# EAGLE design croc (EAGLE 6.3)
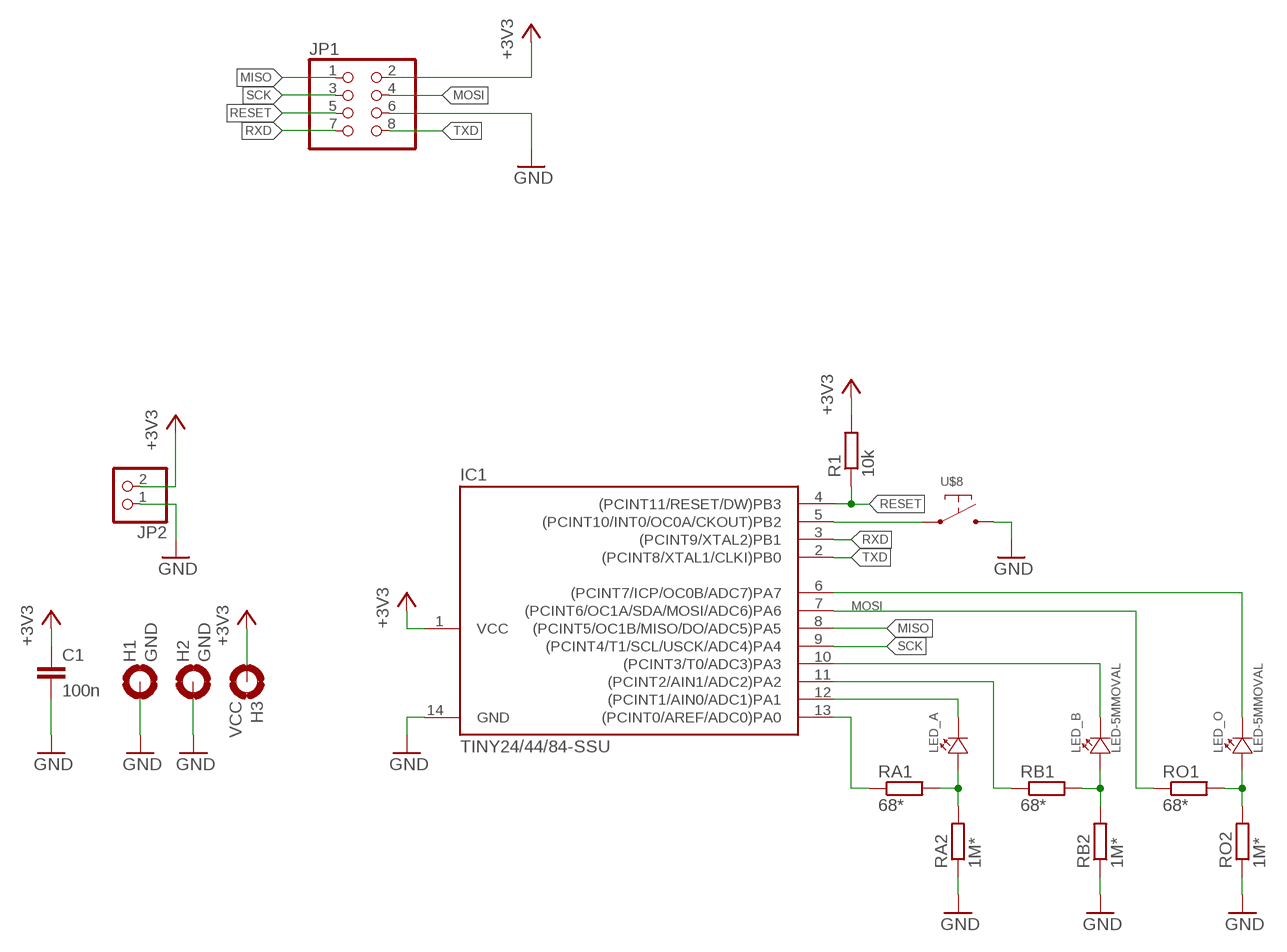
[diagram p0: schematic, sheet 1]

## Parts
C1  100n  C-EUC0603  [C0603]
H1  GND  MOUNT-PAD-ROUND3.0  [3,0-PAD]
H2  GND  MOUNT-PAD-ROUND3.0  [3,0-PAD]
H3  VCC  MOUNT-PAD-ROUND3.0  [3,0-PAD]
IC1  TINY24/44/84-SSU  [SOIC14]
JP1  PINHD-2X4/EDGE  [2X04/EDGE]
JP2  PINHD-1X2  [1X02]
LED_A  LED-5MMOVAL  [LED-5MM-EDGE-OVAL]
LED_B  LED-5MMOVAL  [LED-5MM-EDGE-OVAL]
LED_O  LED-5MMOVAL  [LED-5MM-EDGE-OVAL]
R1  10k  R-EU_R0603  [R0603]
RA1  68*  R-EU_R0603  [R0603]
RA2  1M*  R-EU_R0603  [R0603]
RB1  68*  R-EU_R0603  [R0603]
RB2  1M*  R-EU_R0603  [R0603]
RO1  68*  R-EU_R0603  [R0603]
RO2  1M*  R-EU_R0603  [R0603]
U$8  SWITCH-DEFAULT_OFF-NO_SILK  [SWITCH-GENERIC-4_PIN-NO_SILK]

## Nets
+3V3: C1.1 H3.B3,0(MOUNT) IC1.1(VCC) JP1.2 JP2.2 R1.2
GND: C1.2 H1.B3,0(MOUNT) H2.B3,0(MOUNT) IC1.14(GND) JP1.6 JP2.1 RA2.1 RB2.1 RO2.1 U$8.P$3 U$8.P$4
LED_A-C: IC1.12((PCINT1/AIN0/ADC1)PA1) LED_A.K(C)
LED_A-M: LED_A.A RA1.2 RA2.2
LED_A-S: IC1.13((PCINT0/AREF/ADC0)PA0) RA1.1
LED_B-C: IC1.10((PCINT3/T0/ADC3)PA3) LED_B.K(C)
LED_B-M: LED_B.A RB1.2 RB2.2
LED_B-S: IC1.11((PCINT2/AIN1/ADC2)PA2) RB1.1
LED_O-C: IC1.6((PCINT7/ICP/OC0B/ADC7)PA7) LED_O.K(C)
LED_O-M: LED_O.A RO1.2 RO2.2
MISO: IC1.8((PCINT5/OC1B/MISO/DO/ADC5)PA5) JP1.1
MOSI: IC1.7((PCINT6/OC1A/SDA/MOSI/ADC6)PA6) JP1.4 RO1.1
N$2: IC1.5((PCINT10/INT0/OC0A/CKOUT)PB2) U$8.P$1 U$8.P$2
RESET: IC1.4((PCINT11/RESET/DW)PB3) JP1.5 R1.1
RXD: IC1.3((PCINT9/XTAL2)PB1) JP1.7
SCK: IC1.9((PCINT4/T1/SCL/USCK/ADC4)PA4) JP1.3
TXD: IC1.2((PCINT8/XTAL1/CLKI)PB0) JP1.8

## Library data of the parts
C1 = p.peter-rcl:C-EU: CAPACITOR, European symbol; DIGIKEY: 311-1343-1-ND
H1-H3 = holes:MOUNT-PAD-ROUND: MOUNTING PAD, round
IC1 = avr:TINY24/44/84; DIGIKEY: ATTINY84A-SSU-ND
JP1 = pinhead-mod:PINHD-2X4: PIN HEADER
JP2 = pinhead:PINHD-1X2: PIN HEADER
LED_A LED_B LED_O = p.peter-leds:LED-5MM
R1 = p.peter-rcl:R-EU_: RESISTOR, European symbol; DIGIKEY: 311-10KGRCT-ND
RA1 RA2 RB1 RB2 RO1 RO2 = p.peter-rcl:R-EU_: RESISTOR, European symbol
U$8 = p.peter-passives:SWITCH-DEFAULT_OFF

## Board
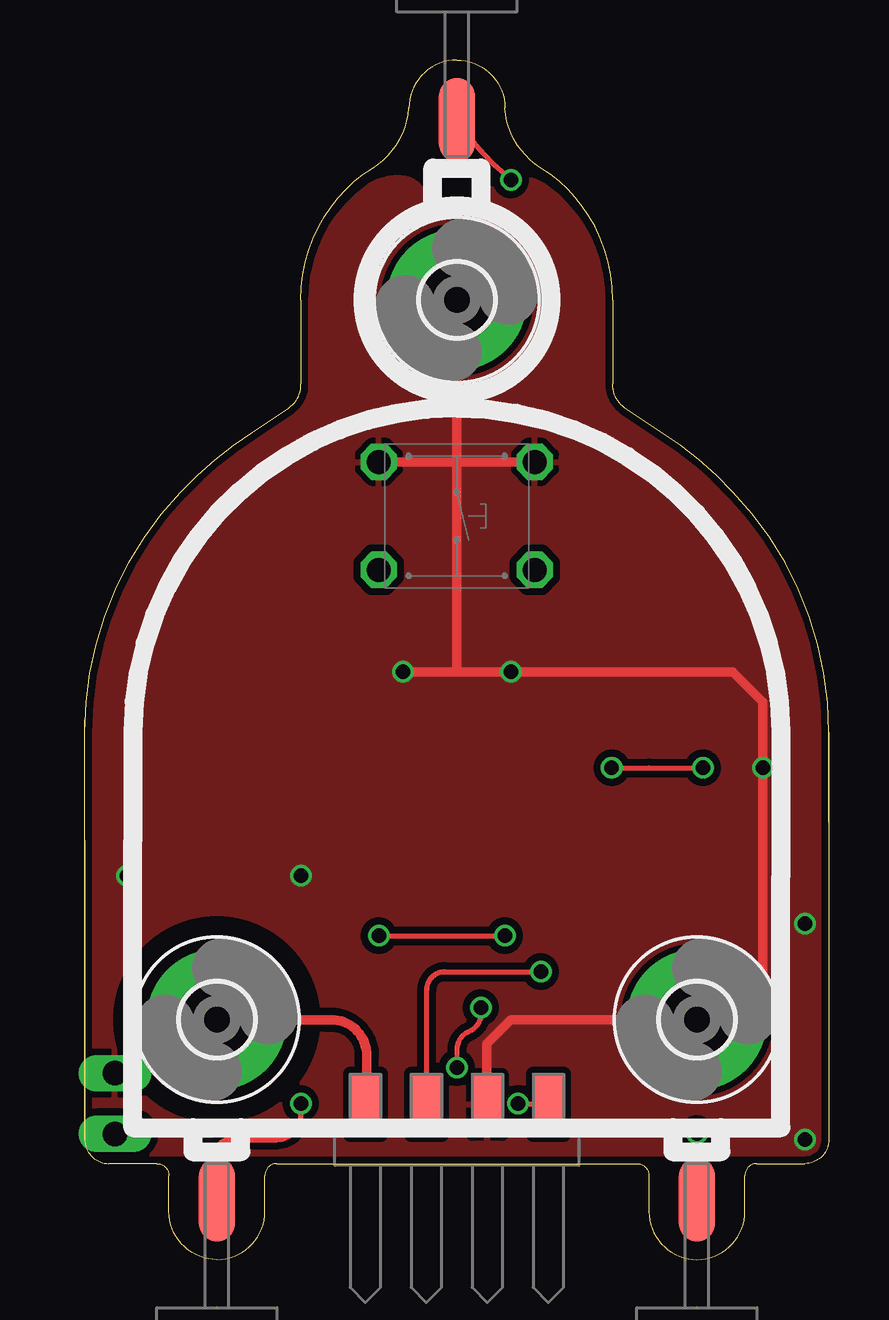
[diagram p1: board, top side]
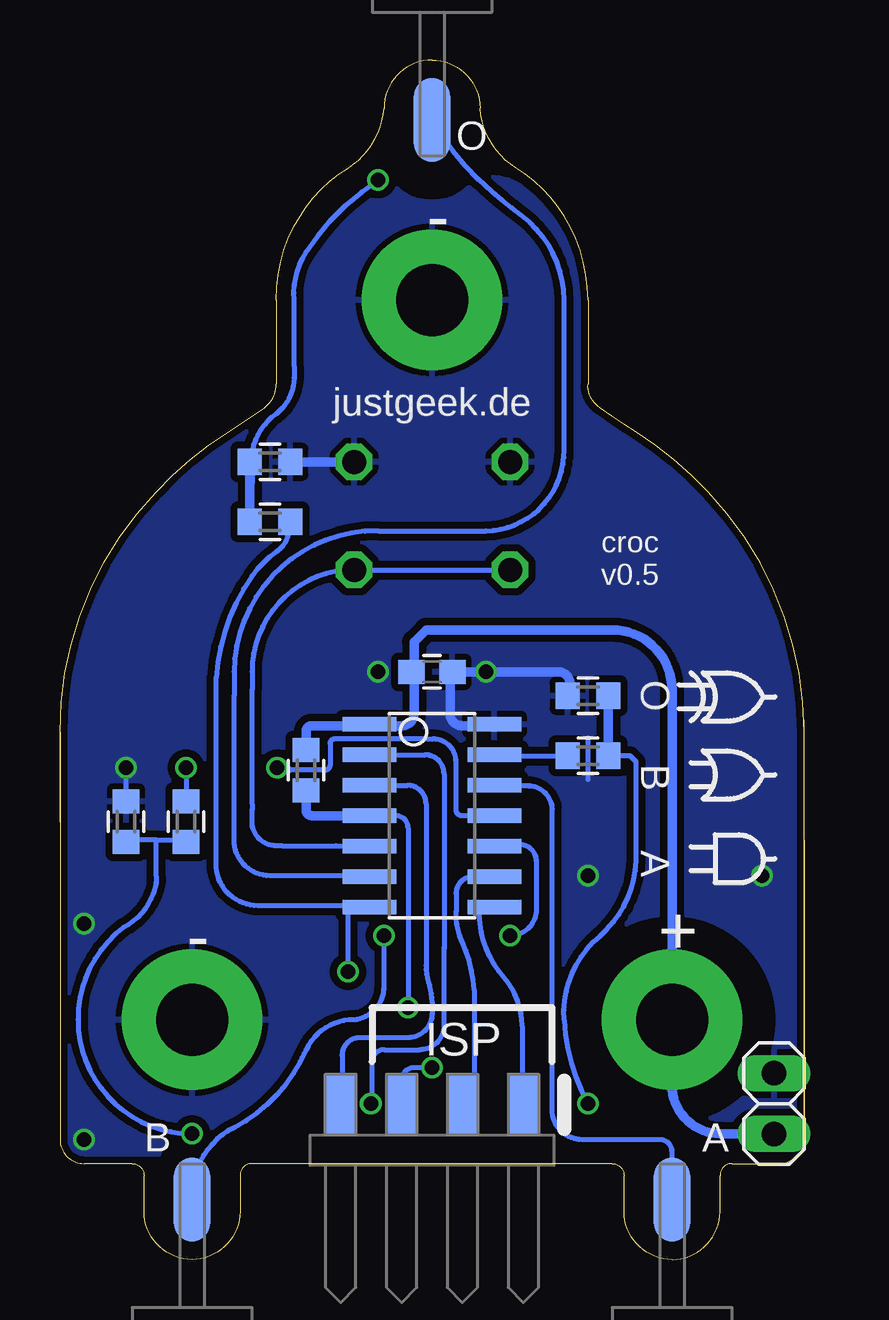
[diagram p2: board, bottom side, seen from below]

Size 31 x 50 mm. Coordinates in mm from the lower left corner, seen from the top.
Outline: 0,17.5 0,5
Outline: 31,18.25 31,22
Outline: 31,22 31,18.25
Outline: 31,18.25 31,5 arc-90 30,4 28,4 arc90 27.5,3.5 27.5,2 arc-90 25.5,0 arc-90 23.5,2 23.5,3.5 arc90 23,4 8,4 arc90 7.5,3.5 7.5,2 arc-90 5.5,0 arc-90 3.5,2 3.5,3.5 arc90 3,4 1,4 arc-90 0,5
Outline: 22,40 arc32 21,43.5
Outline: 21,43.5 arc26 19,45.5 arc-54 17.5,48 arc90 15.5,50 arc90 13.5,48 arc-54 12,45.5 arc26 10,43.5 arc32 9,40 9,36.5 arc-59 8.5,35.5 arc-1 7,34.5 arc13 4,32 arc44 0,22
Outline: 0,5 0,17.5
Outline: 0,17.5 0,18
Outline: 0,18 0,19
Outline: 0,19 0,19.5
Outline: 0,18 0,19
Outline: 0,19 0,19.5
Outline: 0,18 0,19
Outline: 0,19 0,19.5
Outline: 22,40 arc32 21,43.5
Outline: 22,40 22,37
Outline: 0,19.5 0,22
Outline: 0,22 0,22.5
Outline: 0,19 0,22
Outline: 22,40 22,37
Outline: 22,37 22,36.5 arc59 22.5,35.5 arc1 24,34.5 arc-13 27,32 arc-44 31,22
Copper layers (1*16): Top 0.035mm / dielectric 1.5mm / Bottom 0.035mm
Design rules "Fusion_eagle_rule_v1.1": minimum track width 6mil, minimum drill 12mil, track to track 6mil, track to pad 6mil, pad to pad 6mil, via to via 6mil, smd to smd 0mil, copper to edge 10mil, drill to drill 10mil, minimum pad ring 10mil, minimum via ring 6mil, stop-mask expansion 2mil, vias tented up to drill 100mil, thermal gap 10mil
tRestrict: area 1.5,6 to 9.5,14; 29 lines
bRestrict: area 1.5,6 to 9.5,14; 33 lines

### Footprints (pad centres in the part's own frame; a part is rotated, then mirrored left to right if it is on the bottom)
C0603 = smd 1.1 x 1: 1 -0.85,0; 2 0.85,0
3,0-PAD = drill 3 pad 5.842: B3,0 0,0
SOIC14 = smd 0.61 x 2.21: 1 -3.81,-2.603; 2 -2.54,-2.603; 3 -1.27,-2.603; 4 0,-2.603; 5 1.27,-2.603; 6 2.54,-2.603; 7 3.81,-2.603; 8 3.81,2.603; 9 2.54,2.603; 10 1.27,2.603; 11 0,2.603; 12 -1.27,2.603; 13 -2.54,2.603; 14 -3.81,2.603
2X04/EDGE = smd 1.27 x 2.54: 1 3.81,0.46; 3 1.27,0.46; 5 -1.27,0.46; 7 -3.81,0.46 | smd 1.27 x 2.54 bottom: 2 3.81,0.46; 4 1.27,0.46; 6 -1.27,0.46; 8 -3.81,0.46
1X02 = drill 1.016 long: 1 -1.27,0; 2 1.27,0
LED-5MM-EDGE-OVAL = smd 1.5 x 3.5: A 0,0 | smd 1.5 x 3.5 bottom: K 0,0
R0603 = smd 1 x 1.1: 1 -0.85,0; 2 0.85,0
SWITCH-GENERIC-4_PIN-NO_SILK = drill 1 octagon: P$1 2.25,3.25; P$2 2.25,-3.25; P$3 -2.25,3.25; P$4 -2.25,-3.25

### Placement (x,y rotation side)
C1  15.5,24.5 0 bottom
H1  15.5,40 0 top
H2  25.5,10 0 top
H3  5.5,10 0 top
IC1  15.5,18.5 270 bottom
JP1  15.5,6 0 bottom
JP2  1.25,6.5 270 bottom
LED_A  5.5,2.5 180 top
LED_B  25.5,2.5 180 top
LED_O  15.5,47.5 0 top
R1  20.75,20.4 90 bottom
RA1  9,21 0 bottom
RA2  9,23.5 0 bottom
RB1  25.75,18.25 270 bottom
RB2  28.25,18.25 270 bottom
RO1  22.25,30.75 180 bottom
RO2  22.25,33.25 180 bottom
U$8  15.5,31 270 top

### Tracks (layer width: path | path; a pad name or v marks a point on that pad's centre or on a via)
+3V3
  Top 0.4: JP1.2 11.71,6.46 11.75,6.5 11.75,8.5 arc90 10.25,10 10,10 H3.B3,0
  Bottom 0.4: 18,22.25 16.75,22.25 arc-90 16.25,22.75 16.25,24.5 C1.1 16.25,24.6 16.25,25.75 15.75,26.25 8.5,26.25 8,26.25 arc90 5.5,23.75 5.5,22.75 5.5,10.75 H3.B3,0 5.5,7.25 arc-90 3.5,5.25 1.27,5.25 arc90 JP2.2 | 18,22.25 18.04,22.25 IC1.1 18.06,22.31 18,22.25 | 18,22.25 20.5,22.25 arc-90 20.75,22 | 20.75,22 20.75,21.75 | 20.75,21.75 R1.2 | 20.75,22 20.75,21.75
GND  (via drill 0.6)
  Top 0.4: 16.75,6.5 16.77,6.48 JP1.6 16.75,6.48 16.75,9 17.25,9.5 17.75,10 H2.B3,0 27.5,10 28.25,10.75 v28.25,20.5 28.25,23.25 27,24.5 25.75,24.5 15.5,24.5 | 15.5,24.5 15.5,33.25 | 15.5,33.25 H1.B3,0 | U$8.P$4 12.5,33.25 | 12.5,33.25 15.5,33.25 | 15.5,33.25 U$8.P$3 | 12.5,33.25 15.5,33.25 | v13.25,24.5 15.5,24.5
  Bottom 0.2: U$8.P$3 RO2.1 | RB2.1 28.25,19.25 v28.25,20.5 | 9,20 9,21.75
  Bottom 0.4: IC1.14 12.94,22.31 13,22.25 14.25,22.25 arc90 14.75,22.75 14.75,24.4 C1.2 14.5,24.5 v13.25,24.5 10.25,24.5 arc90 9.75,24 9.75,23.5 RA2.1 | U$8.P$3 RO2.1 U$8.P$3
  other vias: 1.75,16 30,5 17.75,24.5 30,14 9,16
  pour Top (isolate 0.3): 0,0 31,0 31,50 0,50
  pour Bottom (isolate 0.3): 0,0 31,0 31,50 0,50
LED_A-C
  Bottom 0.2: LED_A.K 5.5,4.5 arc-90 6,5 9.25,5 arc90 10.5,6.25 10.5,18.75 arc-90 11.5,19.75 12.88,19.75 IC1.12
LED_A-M  (via drill 0.6)
  Top 0.2: LED_A.A 5.5,4.5 arc-90 6,5 8,5 arc90 9,6 v9,6.5
  Bottom 0.2: RA1.2 7.25,21 7,20.75 7,17 arc53 8.5,13.5 arc-53 10,10 arc-25 v9,6.5
  Bottom 0.4: RA2.2 RA1.2
LED_A-S
  Bottom 0.2: IC1.13 12.79,21.04 12.75,21 RA1.1
LED_B-C  (via drill 0.6)
  Top 0.2: v12.25,13.5 v17.5,13.5
  Bottom 0.2: IC1.10 12.25,17.29 | 12.25,17.29 11.88,17.33 | LED_B.K 25.5,3 arc56 23.75,5.5 arc-36 21,8.25 arc-1 20.75,8.75 arc64 18.75,10 arc-90 17.5,11.5 v17.5,13.5 | LED_B.K 25.75,2.25 LED_B.K | 12.25,17.29 11.84,17.29 arc90 11.15,16.6 11.15,14.6 arc90 v12.25,13.5
LED_B-M  (via drill 0.6)
  Top 0.2: LED_B.A v25.5,5.25
  Bottom 0.2: v25.5,5.25 arc90 30.25,10 arc53 28.35,13.85 arc-53 27,15.7 27,16 27,17.5 | 27,17.5 25.85,17.5 RB1.2 | 27,17.5 28.15,17.5 RB2.2
LED_B-S  (via drill 0.6)
  Top 0.2: v21.95,20.5 23.5,20.5 v25.75,20.5
  Bottom 0.2: IC1.11 14.25,18.5 arc90 14.5,18.75 14.5,20.75 arc-90 15.45,21.7 15.7,21.7 19.55,21.7 arc-90 19.75,21.5 19.75,20.6 arc90 19.95,20.4 21.1,20.4 21.4,20.4 21.5,20.5 v21.95,20.5 | v25.75,20.5 RB1.1
LED_O-C
  Bottom 0.2: IC1.6 18.14,16 20.75,16 21.5,16 22.25,16 arc90 23.75,17.5 23.75,23.5 23.75,24.5 arc90 17.75,30.38 13.25,30.38 arc-90 10,33.75 | 10,33.75 10,34 | 10,34 10,40 arc-53 11.75,43.5 arc4 13,44.5 arc19 LED_O.K | 10,33.75 10,34
LED_O-M  (via drill 0.6)
  Top 0.2: v17.75,45 arc-14 LED_O.A
  Bottom 0.2: v17.75,45 arc-22 20.75,42 arc-34 21.25,40 21.25,37.25 21.25,36.75 arc53 22,35.25 arc-39 23,33.75 | 23,33.25 23,33.75 | 23,33.75 23,33.25 | 23,33.25 23,32.35 RO2.2
  Bottom 0.4: RO2.2 RO1.2
MISO
  Bottom 0.2: 11.75,6.52 JP1.1 11.75,6.52 | IC1.8 12.84,14.75 12.25,14.75 13.5,14.75 arc-14 13.5,14 arc-34 12.5,11.75 arc41 11.75,9.75 11.75,6.52
MOSI  (via drill 0.6)
  Top 0.2: JP1.4 14.25,6.48 14.25,6.5 14.25,11.25 arc-90 15,12 v19,12
  Bottom 0.2: 18.29,14.5 IC1.7 | 18.29,14.5 18.25,14.5 19,14.5 v19,12 | 18.29,14.5 18.29,14.71 18.25,14.75 20.25,14.75 22.75,14.75 arc90 24.5,16.5 24.5,17 24.5,24.25 arc30 23,28.5 arc16 22,29.5 arc-53 21.5,30.25 21.5,30.5 21.5,30.75 RO1.1
N$2
  Bottom 0.2: U$8.P$2 U$8.P$1 arc-90 23,24.5 23,23.75 23,23.5 23,19 23,18.75 23,18.25 arc-90 22,17.25 21.75,17.25 19.5,17.25 18.12,17.25 IC1.5
RESET  (via drill 0.6)
  Top 0.2: v16.5,10.5 16.5,10.25 arc-67 16,9.5 arc67 15.5,8.75 v15.5,8
  Bottom 0.2: IC1.4 17,18.5 arc90 16.5,18 v16.5,10.5 | 16.75,6.48 JP1.5 16.75,6.48 | v15.5,8 16.25,8 arc-90 16.75,7.5 16.75,6.48
  Bottom 0.4: R1.1 20.75,18.75 arc-90 20.5,18.5 IC1.4
RXD
  Bottom 0.2: IC1.3 16.52,19.77 arc90 15.75,19 15.75,12.25 arc-20 15.6,11.4 arc17 15.5,10.75 15.5,10.25 arc90 16.5,9.25 18.5,9.25 arc-90 19.25,8.5 19.25,6.52 | 19.25,6.52 JP1.7 19.25,6.52
SCK
  Bottom 0.2: IC1.9 13.79,15.96 arc-90 14.5,15.25 14.5,14.5 arc-23 14.25,13.25 arc23 13.75,11.25 13.75,7.5 14,6.5 14.19,6.5 JP1.3 14.25,6.48
TXD  (via drill 0.6)
  Top 0.2: 19.31,6.75 JP1.8 19.27,6.5 v18.05,6.5 | 19.31,6.75 19.31,6.94 | 19.56,6.5 19.31,6.75
  Bottom 0.2: IC1.2 15.79,21.04 arc90 15,20.25 15,13 | 15,13 15,12.95 | v18.05,6.5 18,6.5 18,8.25 arc90 17.5,8.75 16,8.75 arc-90 15,9.75 15,13

### Text on the board
bPlace: O | - | justgeek.de | croc / v0.5 | O | B | A | + | - | ISP | A | B